# Altium schematic sheet Modulator.SchDoc: Class-D audio amplifier
size A4; Engineer: CT; SheetNumber: 1; SheetTotal: 1
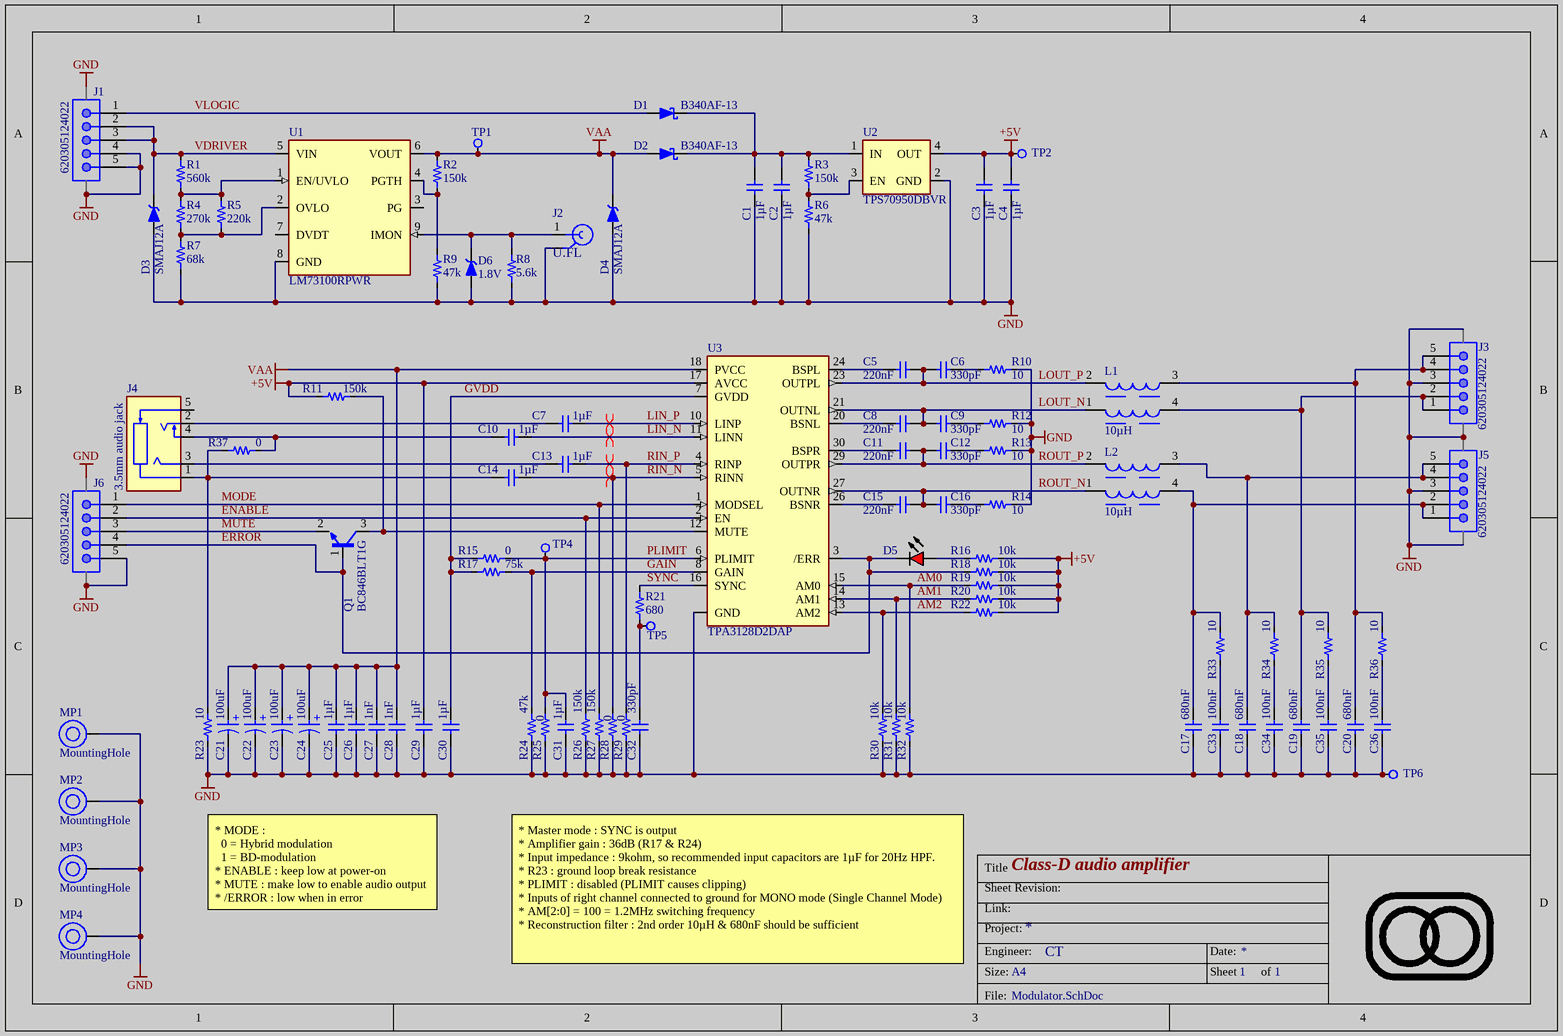
[diagram p0: Modulator.SchDoc]

## Parts
C1  value 1µF  [1206-C-N]  (hidden comment: Capacitor 1µF +/-10% 50V X7R 1206)
C2  value 1µF  [1206-C-N]  (hidden comment: Capacitor 1µF +/-10% 50V X7R 1206)
C3  value 1µF  [1206-C-N]  (hidden comment: Capacitor 1µF +/-10% 50V X7R 1206)
C4  value 1µF  [1206-C-N]  (hidden comment: Capacitor 1µF +/-10% 50V X7R 1206)
C5  value 220nF  [0805-C-N]  (hidden comment: Capacitor 220nF +/-10% 50V X7R 0805)
C6  value 330pF  [0603-C-N]  (hidden comment: Capacitor 330pF +/-5% 50V NP0 0603)
C7  value 1µF  [1206-C-N]  (hidden comment: Capacitor 1µF +/-10% 50V X7R 1206)
C8  value 220nF  [0805-C-N]  (hidden comment: Capacitor 220nF +/-10% 50V X7R 0805)
C9  value 330pF  [0603-C-N]  (hidden comment: Capacitor 330pF +/-5% 50V NP0 0603)
C10  value 1µF  [1206-C-N]  (hidden comment: Capacitor 1µF +/-10% 50V X7R 1206)
C11  value 220nF  [0805-C-N]  (hidden comment: Capacitor 220nF +/-10% 50V X7R 0805)
C12  value 330pF  [0603-C-N]  (hidden comment: Capacitor 330pF +/-5% 50V NP0 0603)
C13  value 1µF  [1206-C-N]  (hidden comment: Capacitor 1µF +/-10% 50V X7R 1206)
C14  value 1µF  [1206-C-N]  (hidden comment: Capacitor 1µF +/-10% 50V X7R 1206)
C15  value 220nF  [0805-C-N]  (hidden comment: Capacitor 220nF +/-10% 50V X7R 0805)
C16  value 330pF  [0603-C-N]  (hidden comment: Capacitor 330pF +/-5% 50V NP0 0603)
C17  value 680nF  [1206-C-N]  (hidden comment: Capacitor 680nF +/-10% 50V X7R 1206)
C18  value 680nF  [1206-C-N]  (hidden comment: Capacitor 680nF +/-10% 50V X7R 1206)
C19  value 680nF  [1206-C-N]  (hidden comment: Capacitor 680nF +/-10% 50V X7R 1206)
C20  value 680nF  [1206-C-N]  (hidden comment: Capacitor 680nF +/-10% 50V X7R 1206)
C21  Capacitance: 100uF  [WCAP-HSAH_D6.3H7.7]  (hidden comment: 875585545003)
C22  Capacitance: 100uF  [WCAP-HSAH_D6.3H7.7]  (hidden comment: 875585545003)
C23  Capacitance: 100uF  [WCAP-HSAH_D6.3H7.7]  (hidden comment: 875585545003)
C24  Capacitance: 100uF  [WCAP-HSAH_D6.3H7.7]  (hidden comment: 875585545003)
C25  value 1µF  [1206-C-N]  (hidden comment: Capacitor 1µF +/-10% 50V X7R 1206)
C26  value 1µF  [1206-C-N]  (hidden comment: Capacitor 1µF +/-10% 50V X7R 1206)
C27  value 1nF  [0603-C-N]  (hidden comment: Capacitor 1nF +/-5% 100V NP0 0603)
C28  value 1nF  [0603-C-N]  (hidden comment: Capacitor 1nF +/-5% 100V NP0 0603)
C29  value 1µF  [1206-C-N]  (hidden comment: Capacitor 1µF +/-10% 50V X7R 1206)
C30  value 1µF  [1206-C-N]  (hidden comment: Capacitor 1µF +/-10% 50V X7R 1206)
C31  value 1µF  [1206-C-N]  (hidden comment: Capacitor 1µF +/-10% 50V X7R 1206)
C32  value 330pF  [0603-C-N]  (hidden comment: Capacitor 330pF +/-5% 50V NP0 0603)
C33  value 100nF  [1206-C-N]  (hidden comment: Capacitor 100nF +/-10% 50V X7R 1206)
C34  value 100nF  [1206-C-N]  (hidden comment: Capacitor 100nF +/-10% 50V X7R 1206)
C35  value 100nF  [1206-C-N]  (hidden comment: Capacitor 100nF +/-10% 50V X7R 1206)
C36  value 100nF  [1206-C-N]  (hidden comment: Capacitor 100nF +/-10% 50V X7R 1206)
D1  B340AF-13  [DO-214AC_UNI]
D2  B340AF-13  [DO-214AC_UNI]
D3  SMAJ12A  [DO-214AC_UNI]
D4  SMAJ12A  [DO-214AC_UNI]
D5  150060RS86000  [WL-SMCW_0603_150060xx8x000]  (value not drawn)
D6  Working Voltage: 1.8V  [SOD-123-N]  (hidden comment: DDZ9678-7)
J1  620305124022  [620305124022]
J2  U.FL-R-SMT(10)  [HRS-U.FL-R-SMT_V]  (value not drawn)
J3  620305124022  [620305124022]
J4  value 3.5mm audio jack  [SJ2-35863B1-SMT-TR-Footprint-1]  (hidden comment: SJ2-35863B1-SMT-TR)
J5  620305124022  [620305124022]
J6  620305124022  [620305124022]
L1  Inductance: 10µH  [WE-LHMD_1008]  (hidden comment: 74434301008100)
L2  Inductance: 10µH  [WE-LHMD_1008]  (hidden comment: 74434301008100)
MP1  MountingHole  [PTH-M3D6.5_VIA-RING]  (no BOM)
MP2  MountingHole  [PTH-M3D6.5_VIA-RING]  (no BOM)
MP3  MountingHole  [PTH-M3D6.5_VIA-RING]  (no BOM)
MP4  MountingHole  [PTH-M3D6.5_VIA-RING]  (no BOM)
Q1  BC846BLT1G  [SOT-23-3-N]
R1  value 560k  [0603-R-N]  (hidden comment: ERJ-3EKF5603V)
R2  value 150k  [0603-R-N]  (hidden comment: Resistor 150k +/-1% 50V 0603)
R3  value 150k  [0603-R-N]  (hidden comment: Resistor 150k +/-1% 50V 0603)
R4  value 270k  [0603-R-N]  (hidden comment: RC0603FR-07270KL)
R5  value 220k  [0603-R-N]  (hidden comment: Resistor 220k 1% 0603 0.1W)
R6  value 47k  [0603-R-N]  (hidden comment: Resistor 47k +/-1% 50V 0603)
R7  value 68k  [0603-R-N]  (hidden comment: Resistor 68k +/-1% 50V 0603)
R8  value 5.6k  [0603-R-N]  (hidden comment: Resistor 5.6k +/-1% 0.1W 0603)
R9  value 47k  [0603-R-N]  (hidden comment: Resistor 47k +/-1% 50V 0603)
R10  value 10  [1206-R-N]  (hidden comment: Resistor 10E +/-1% 200V 1206)
R11  value 150k  [0603-R-N]  (hidden comment: Resistor 150k +/-1% 50V 0603)
R12  value 10  [1206-R-N]  (hidden comment: Resistor 10E +/-1% 200V 1206)
R13  value 10  [1206-R-N]  (hidden comment: Resistor 10E +/-1% 200V 1206)
R14  value 10  [1206-R-N]  (hidden comment: Resistor 10E +/-1% 200V 1206)
R15  value 0  [0603-R-N]  (hidden comment: Jumper 0R <50 mOhm 1A 0603)
R16  value 10k  [0603-R-N]  (hidden comment: Resistor 10k +/-1% 50V 0603)
R17  value 75k  [0603-R-N]  (hidden comment: Resistor 75k +/-1% 50V 0603)
R18  value 10k  [0603-R-N]  (hidden comment: Resistor 10k +/-1% 50V 0603)
R19  value 10k  [0603-R-N]  (hidden comment: Resistor 10k +/-1% 50V 0603)
R20  value 10k  [0603-R-N]  (hidden comment: Resistor 10k +/-1% 50V 0603)
R21  value 680  [0603-R-N]  (hidden comment: RMCF0603FT680R)
R22  value 10k  [0603-R-N]  (hidden comment: Resistor 10k +/-1% 50V 0603)
R23  value 10  [0603-R-N]  (hidden comment: Resistor 10R +/-1% 50V 0603)
R24  value 47k  [0603-R-N]  (hidden comment: Resistor 47k +/-1% 50V 0603)
R25  value 0  [0603-R-N]  (hidden comment: Jumper 0R <50 mOhm 1A 0603)
R26  value 150k  [0603-R-N]  (hidden comment: Resistor 150k +/-1% 50V 0603)
R27  value 150k  [0603-R-N]  (hidden comment: Resistor 150k +/-1% 50V 0603)
R28  value 0  [0603-R-N]  (hidden comment: Jumper 0R <50 mOhm 1A 0603)
R29  value 0  [0603-R-N]  (hidden comment: Jumper 0R <50 mOhm 1A 0603)
R30  value 10k  [0603-R-N]  (hidden comment: Resistor 10k +/-1% 50V 0603)
R31  value 10k  [0603-R-N]  (hidden comment: Resistor 10k +/-1% 50V 0603)
R32  value 10k  [0603-R-N]  (hidden comment: Resistor 10k +/-1% 50V 0603)
R33  value 10  [1206-R-N]  (hidden comment: Resistor 10E +/-1% 200V 1206)
R34  value 10  [1206-R-N]  (hidden comment: Resistor 10E +/-1% 200V 1206)
R35  value 10  [1206-R-N]  (hidden comment: Resistor 10E +/-1% 200V 1206)
R36  value 10  [1206-R-N]  (hidden comment: Resistor 10E +/-1% 200V 1206)
R37  value 0  [0603-R-N]  (hidden comment: Jumper 0R <50 mOhm 1A 0603)
TP1  Testpad with multiple sizes  [TP_1.5mm_0.3mmHole]  (value not drawn)  (no BOM)
TP2  Testpad with multiple sizes  [TP_1.5mm_0.3mmHole]  (value not drawn)  (no BOM)
TP4  Testpad with multiple sizes  [TP_1.5mm_0.3mmHole]  (value not drawn)  (no BOM)
TP5  Testpad with multiple sizes  [TP_1.5mm_0.3mmHole]  (value not drawn)  (no BOM)
TP6  Testpad with multiple sizes  [TP_1.5mm_0.3mmHole]  (value not drawn)  (no BOM)
U1  LM73100RPWR  [VQFN-HR]
U2  TPS70950DBVR  [SOT25-N]
U3  TPA3128D2DAP  [TSSOP28_PPad]

## Nets
+5V: C3.2 C4.2 C29.2 R11.1 R16.2 R18.1 R19.1 R20.1 R22.1 TP2.1(Pad) U2.4(OUT) U3.17(AVCC)
GND: C1.1 C2.1 C3.1 C4.1 C17.1 C18.1 C19.1 C20.1 C21.2(N) C22.2(N) C23.2(N) C24.2(N) C25.2 C26.2 C27.1 C28.1 C29.1 C30.1 C31.1 C32.2 C33.1 C34.1 C35.1 C36.1 D3.2(A) D4.2(A) D6.2(A) J1.4 J1.5 J1.MP1 J1.MP2 J2.2(GND) J3.3 J3.MP1 J3.MP2 J5.3 J5.MP1 J5.MP2 J6.5 J6.MP1 J6.MP2 MP1.1(H1) MP2.1(H1) MP3.1(H1) MP4.1(H1) R6.2 R7.1 R8.1 R9.1 R10.2 R12.2 R13.2 R14.2 R23.1 R24.1 R25.1 R26.1 R27.1 R28.1 R29.1 R30.2 R31.2 R32.2 TP6.1(Pad) U1.8(GND) U2.2(GND) U3.9(GND)
VAA: C21.1(P) C22.1(P) C23.1(P) C24.1(P) C25.1 C26.1 C27.2 C28.2 D2.2(A) D4.1(K) R2.1 TP1.1(Pad) U1.6(VOUT) U3.18(PVCC)
AM0: R19.2 R32.1 U3.15(AM0)
AM1: R20.2 R31.1 U3.14(AM1)
AM2: R22.2 R30.1 U3.13(AM2)
ENABLE: J6.2 R26.2 U3.2(EN)
ERROR: D5.1(K) J6.4 Q1.1(B) R18.2 U3.3(/ERR)
GAIN: R17.1 R24.2 U3.8(GAIN)
GVDD: C30.2 R15.1 R17.2 U3.7(GVDD)
LIN_N: C10.1 U3.11(LINN)
LIN_P: C7.1 U3.10(LINP)
LOUT_N: C8.2 C9.2 L1.1 U3.21(OUTNL)
LOUT_P: C5.2 C6.2 L1.2 U3.23(OUTPL)
MODE: J6.1 R27.2 U3.1(MODSEL)
MUTE: J6.3 Q1.2(E)
PLIMIT: C31.2 R15.2 R25.2 TP4.1(Pad) U3.6(PLIMIT)
RIN_N: C14.1 R28.2 U3.5(RINN)
RIN_P: C13.1 R29.2 U3.4(RINP)
ROUT_N: C15.2 C16.2 L2.1 U3.27(OUTNR)
ROUT_P: C11.2 C12.2 L2.2 U3.29(OUTPR)
SYNC: R21.2 U3.16(SYNC)
VDRIVER: D3.1(K) J1.2 J1.3 R1.2 U1.5(VIN)
VLOGIC: D1.2(A) J1.1
NetC1_2: C1.2 C2.2 D1.1(K) D2.1(K) R3.1 U2.1(IN)
NetC5_1: C5.1 U3.24(BSPL)
NetC6_1: C6.1 R10.1
NetC7_2: C7.2 J4.2
NetC8_1: C8.1 U3.20(BSNL)
NetC9_1: C9.1 R12.1
NetC10_2: C10.2 J4.4 R37.2
NetC11_1: C11.1 U3.30(BSPR)
NetC12_1: C12.1 R13.1
NetC13_2: C13.2 J4.3
NetC14_2: C14.2 J4.1 R23.2 R37.1
NetC15_1: C15.1 U3.26(BSNR)
NetC16_1: C16.1 R14.1
NetC17_2: C17.2 J5.1 J5.2 L2.4 R33.2
NetC18_2: C18.2 J5.4 J5.5 L2.3 R34.2
NetC19_2: C19.2 J3.1 J3.2 L1.4 R35.2
NetC20_2: C20.2 J3.4 J3.5 L1.3 R36.2
NetC32_1: C32.1 R21.1 TP5.1(Pad)
NetC33_2: C33.2 R33.1
NetC34_2: C34.2 R34.1
NetC35_2: C35.2 R35.1
NetC36_2: C36.2 R36.1
NetD5_2: D5.2(A) R16.1
NetD6_1: D6.1(K) J2.1(SIG) R8.2 U1.9(IMON)
NetQ1_3: Q1.3(C) R11.2 U3.12(MUTE)
NetR1_1: R1.1 R4.2 R5.2 U1.1(EN/UVLO)
NetR2_2: R2.2 R9.2 U1.4(PGTH)
NetR3_2: R3.2 R6.1 U2.3(EN)
NetR4_1: R4.1 R5.1 R7.2 U1.2(OVLO)

Not connected (* = marked no-connect by the designer): J4 5; U1 3(PG) 7(DVDT)

## Layout directives
differential pair: LIN_N, LIN_P, RIN_N, RIN_P

## Notes on the sheet
- * MODE :
  0 = Hybrid modulation
  1 = BD-modulation
  * ENABLE : keep low at power-on
  * MUTE : make low to enable audio output
  * /ERROR : low when in error
- * Master mode : SYNC is output
  * Amplifier gain : 36dB (R17 & R24)
  * Input impedance : 9kohm, so recommended input capacitors are 1µF for 20Hz HPF.
  * R23 : ground loop break resistance
  * PLIMIT : disabled (PLIMIT causes clipping)
  * Inputs of right channel connected to ground for MONO mode (Single Channel Mode)
  * AM[2:0] = 100 = 1.2MHz switching frequency
  * Reconstruction filter : 2nd order 10µH & 680nF should be sufficient
- Title
- Sheet Revision:
- Link:
- Size:
- Project:
- Engineer:
- A4
- Date:
- Sheet
- of
- File:
- (in symbol CMP-171-000008-3) +

## Library data of the parts
C1-C4 = CMP-072-000852-15: WCAP-CSGP Multilayer Ceramic Chip Capacitor, General Purpose, size 1206, X7R, 1µF, 50VDC; Page Part #: CCOK105; Technical Reference: X7R1206105K050DFCT10000; Capacitor Type: MLCC; Tolerance: 10%; Insulation Resistance: 0.5GO; Dissipation Factor: 3%; Source: WCAP-CSGP.SchLib; Width: 1.6mm; Voltage Rating: 50V; Case/Package: 1206; Min Operating Temperature: -55°C; Design Item ID: 885012208093; JLCPCB Part #: C1848; Height: 1.6mm; Match Code: WCAP-CSGP; Mounting Technology: SMT; ComponentLink2Description: Datasheet Link; Packaging: Tape and Reel; Usage: General Purpose; Max Operating Temperature: 125°C; ComponentLink1Description: Website Link; Length: 3.2mm; Dielectric: X7R; ComponentLink2URL: https://www.we-online.com/redexpert/spec/885012208093?ad; Pins: 2; ComponentLink1URL: https://www.we-online.com/redexpert/article/885012208093?ad
C5 C8 C11 C15 = CMP-072-000738-14: WCAP-CSGP Multilayer Ceramic Chip Capacitor, General Purpose, size 0805, X7R, 220nF, 50VDC; Capacitor Type: MLCC; Technical Reference: X7R0805224K050DFCT10000; Insulation Resistance: 2.3GO; Dissipation Factor: 3%; Tolerance: 10%; Width: 1.25mm; Dielectric: X7R; Case/Package: 0805; ComponentLink2Description: Datasheet Link; Usage: General Purpose; Pins: 2; JLCPCB Part #: C5378; Design Item ID: 885012207100; ComponentLink2URL: https://www.we-online.com/redexpert/spec/885012207100?ad; Max Operating Temperature: 125°C; Length: 2mm; Source: WCAP-CSGP.SchLib; Packaging: Tape and Reel; ComponentLink1URL: https://www.we-online.com/redexpert/article/885012207100?ad; Match Code: WCAP-CSGP; Voltage Rating: 50V; ComponentLink1Description: Website Link; Mounting Technology: SMT; Height: 1.25mm; Min Operating Temperature: -55°C
C6 C9 C12 C16 C32 = CMP-072-000131-14: WCAP-CSGP Multilayer Ceramic Chip Capacitor, General Purpose, size 0603, NP0, 330pF, 50VDC; Tolerance: 5%; Q Factor: 1000; Technical Reference: NP00603331J050DFCT10000; Insulation Resistance: 10GO; Capacitor Type: MLCC; Match Code: WCAP-CSGP; Max Operating Temperature: 125°C; ComponentLink1Description: Website Link; Length: 1.6mm; ComponentLink2URL: https://www.we-online.com/redexpert/spec/885012006060?ad; Min Operating Temperature: -55°C; Voltage Rating: 50V; Mounting Technology: SMT; ComponentLink1URL: https://www.we-online.com/redexpert/article/885012006060?ad; Design Item ID: 885012006060; Source: WCAP-CSGP.SchLib; JLCPCB Part #: C62784; Pins: 2; Height: 0.8mm; ComponentLink2Description: Datasheet Link; Dielectric: NP0; Packaging: Tape and Reel; Width: 0.8mm; Usage: General Purpose; Case/Package: 0603
C7 C10 C13 C14 C25 C26 C29-C31 = CMP-072-000852-15: WCAP-CSGP Multilayer Ceramic Chip Capacitor, General Purpose, size 1206, X7R, 1µF, 50VDC; Page Part #: CCOK105; Dissipation Factor: 3%; Tolerance: 10%; Technical Reference: X7R1206105K050DFCT10000; Insulation Resistance: 0.5GO; Capacitor Type: MLCC; Mounting Technology: SMT; ComponentLink2Description: Datasheet Link; Width: 1.6mm; Length: 3.2mm; Match Code: WCAP-CSGP; Voltage Rating: 50V; Packaging: Tape and Reel; ComponentLink1Description: Website Link; ComponentLink2URL: https://www.we-online.com/redexpert/spec/885012208093?ad; Pins: 2; Height: 1.6mm; Max Operating Temperature: 125°C; Min Operating Temperature: -55°C; Dielectric: X7R; Design Item ID: 885012208093; Source: WCAP-CSGP.SchLib; Usage: General Purpose; JLCPCB Part #: C1848; Case/Package: 1206; ComponentLink1URL: https://www.we-online.com/redexpert/article/885012208093?ad
C17-C20 = CMP-072-000851-13: WCAP-CSGP Multilayer Ceramic Chip Capacitor, General Purpose, size 1206, X7R, 680nF, 50VDC; Capacitor Type: MLCC; Insulation Resistance: 0.7GO; Technical Reference: X7R1206684K050DFCT10000; Tolerance: 10%; Dissipation Factor: 3%; Voltage Rating: 50V; Pins: 2; Source: WCAP-CSGP.SchLib; Mounting Technology: SMT; Case/Package: 1206; Match Code: WCAP-CSGP; Design Item ID: 885012208092; Usage: General Purpose; Height: 1.6mm; Packaging: Tape and Reel; Max Operating Temperature: 125°C; Min Operating Temperature: -55°C; ComponentLink1URL: https://www.we-online.com/redexpert/article/885012208092?ad; Length: 3.2mm; Dielectric: X7R; JLCPCB Part #: C282780; ComponentLink2Description: Datasheet Link; Width: 1.6mm; ComponentLink2URL: https://www.we-online.com/redexpert/spec/885012208092?ad; ComponentLink1Description: Website Link
C21-C24 = CMP-171-000008-3: WCAP-HSAH Aluminum Hybrid Polymer Capacitor, SMT, D6.3 x H7.7mm, 100uF, 25V; Manufacturer: Wurth Elektronik; Leakage Current: 25uA; Dissipation Factor: 14%; Ripple Current: 1400mA; ESR: 30mOhm; Endurance: 4000h; Packaging: Tape and Reel; ComponentLink2Description: Datasheet Link; Design Item ID: 875585545003; ComponentLink1Description: Website Link; Diameter: 6.3mm; JLCPCB Part #: C22395169; Category: Aluminum Hybrid Polymer Capacitors; Manufacturer Part Number: 875585545003; Operating Temperature Min: -55°C; Mount: Surface Mount; Component Type: Standard; Rated Voltage (DC): 25V; Source: WCAP-HSAH.SchLib; Height: 7.7mm; Pin Count: 2; Operating Temperature Max: 125°C; ComponentLink2URL: https://www.we-online.com/redexpert/spec/875585545003?ad; Match Code: WCAP-HSAH; ComponentLink1URL: https://www.we-online.com/redexpert/article/875585545003?ad
C27 C28 = CMP-072-000145-17: WCAP-CSGP Multilayer Ceramic Chip Capacitor, General Purpose, size 0603, NP0, 1nF, 100VDC; FLIR Part #: YCAM1N-1; Capacitor Type: MLCC; Insulation Resistance: 10GO; Technical Reference: NP00603102J100DFCT10000; Tolerance: 5%; Q Factor: 1000; Voltage Rating: 100V; ComponentLink2Description: Datasheet Link; ComponentLink2URL: https://www.we-online.com/redexpert/spec/885012006085?ad; JLCPCB Part #: C153291; ComponentLink1Description: Website Link; Usage: General Purpose; Height: 0.8mm; Width: 0.8mm; Source: WCAP-CSGP.SchLib; Match Code: WCAP-CSGP; Pins: 2; Length: 1.6mm; ComponentLink1URL: https://www.we-online.com/redexpert/article/885012006085?ad; Dielectric: NP0; Packaging: Tape and Reel; Design Item ID: 885012006085; Case/Package: 0603; Min Operating Temperature: -55°C; Max Operating Temperature: 125°C; Mounting Technology: SMT; Page Part #: ?
C33-C36 = CMP-072-000846-14: WCAP-CSGP Multilayer Ceramic Chip Capacitor, General Purpose, size 1206, X7R, 100nF, 50VDC; Dissipation Factor: 2.5%; Capacitor Type: MLCC; Tolerance: 10%; Technical Reference: X7R1206104K050DFCT10000; Insulation Resistance: 5GO; Case/Package: 1206; Source: WCAP-CSGP.SchLib; Match Code: WCAP-CSGP; Mounting Technology: SMT; ComponentLink1URL: https://www.we-online.com/redexpert/article/885012208087?ad; Min Operating Temperature: -55°C; ComponentLink2URL: https://www.we-online.com/redexpert/spec/885012208087?ad; Pins: 2; JLCPCB Part #: C82601; Usage: General Purpose; Max Operating Temperature: 125°C; Packaging: Tape and Reel; Voltage Rating: 50V; Width: 1.6mm; Dielectric: X7R; Length: 3.2mm; ComponentLink2Description: Datasheet Link; Height: 0.8mm; ComponentLink1Description: Website Link; Design Item ID: 885012208087
D1 D2 = CMP-004-00050-6: Diode 40 V 3A Surface Mount SMAF; Forward Voltage: 500 mV @ 3 A; Max Reverse Voltage (DC): 40V; JLCPCB Part #: C172880; Forward Current: 3A; Mounting Technology: Surface Mount; Case/Package: SMA; RoHS Compliant: Yes; Series: -; Packaging: Cut Tape
D3 D4 = CMP-104-000003-5: SMAJ Series 19.9 V 0.4 kW Surface Mount Uni-Directional TVS Diode - DO-214AC; Manufacturer Part Number: 824500121; Manufacturer: Wurth Elektronik; Polarity: Unidirectional; Power Dissipation: 400W; Operating Voltage (DC): 12V; (Reverse) Breakdown Voltage: 14V; Match Code: WE-TVSP; Clamping Voltage: 19.9V; Value: 12V; (Reverse) Peak Pulse Current: 20.1A; Length: 4.5mm; Packaging: Tape and Reel; Case/Size Code: DO-214AC; Operating Temperature Min: -65°C; Height: 2.087mm; Source: WE-TVSP.SchLib; Component Type: Standard; Category: Surge Protection; Mount: Surface Mount; Pin Count: 2; ComponentLink2URL: https://www.we-online.com/redexpert/spec/824500121?ad; Design Item ID: 824500121; JLCPCB Part #: C89613; ComponentLink2Description: Datasheet Link; ComponentLink1URL: https://www.we-online.com/redexpert/article/824500121?ad; Width: 2.79mm; Operating Temperature Max: 150°C; ComponentLink1Description: Website Link
D5 = CMP-002-001080-9: WL-SMCW Mono-color Chip LED Waterclear, size 0603, Red, 2V, 60°; Manufacturer: Wurth Elektronik; Case/Size Code: 0603; Dominant Wavelength: 624nm; Peak Wavelength: 632nm; Luminous Intensity: 800mcd; Chip Technology: AlInGaP; Match Code: WL-SMCW; Source: WL-SMCW.SchLib; Length: 1.6mm; Height: 0.95mm; Emitting Color: Red; Forward Voltage: 2V; ComponentLink1URL: https://www.we-online.com/redexpert/article/150060RS86000?ad; Operating Temperature Min: -40°C; Mount: Surface Mount; Pin Count: 2; Design Item ID: 150060RS86000; ComponentLink1Description: Website Link; Packaging: Tape and Reel; ComponentLink2URL: https://www.we-online.com/redexpert/spec/150060RS86000?ad; JLCPCB Part #: C5875741; Operating Temperature Max: 85°C; Manufacturer Part Number: 150060RS86000; ComponentLink2Description: Datasheet Link; Viewing Angle: 60°; Category: Signal LEDs; Component Type: Standard; Width: 0.8mm
D6 = CMP-004-00056-2: Vz=1.8V 1.71V~1.89V Izt=50uA P=500mW; Forward Voltage: 900mV; Max Reverse Current: 7.5uA; Test Current: 50uA; Power Dissipation: 500mW; Tolerance: 5%; Series: -; Package Quantity: 3000; Zener Current: 7.5uA; Min Operating Temperature: -65°C; Reach SVHC Compliant: No; Width: 1.7mm; Max Operating Temperature: 150°C; Max Power Dissipation: 500mW; Case/Package: SOD-123-2; Zener Voltage: 1.8V; Weight: 0.000353oz; Height: 1.35mm; Lead Free: Lead Free; Radiation Hardening: No; Length: 3.85mm; JLCPCB Part #: C150464; Max Reverse Leakage Current: 7.5uA; Power Rating: 500mW; Packaging: Tape and Reel; Pins: 2; Mounting Technology: Surface Mount; Voltage Tolerance: 5%; RoHS Compliant: Yes
J1 J3 J5 J6 = CMP-047-000052-7: WR-WTB SMT Male Vertical Shrouded Header, pitch 2mm, 5p; Withstanding Voltage: 800VAC; Pin Number: 5; Working Voltage: 100VAC; Contact Resistance: 20mOhm; Rated Current: 2A; Type: Vertical; JLCPCB Part #: C265085; ComponentLink2Description: Datasheet; Part Number: 620305124022; Pin Count: 5; Publisher: Wurth Elektronik; Component Type: Standard; ComponentLink1Description: Manufacturer; Source: WR-WTB_2.00mm.SchLib; Mounting Technology: SMT; Pitch: 2mm; Operating Temperature: -25 to +85degC; Published Date: January 2020; ComponentLink1URL: http://www.we-online.de; Design Item ID: 620305124022; Gender: Male; Packaging: Tape and Reel; ComponentLink2URL: https://www.we-online.com/catalog/datasheet/620305124022.pdf
J2 = CMP-002-00035-12: Ultra Small Surface Mount Coaxial Connector, 50 Ohm, -40 to 90 degC, 3-Pin SMD, RoHS, Tape and Reel; pin to pad: 1>3 2>1+2; Manufacturer: Hirose Electric; Resistance: 50Ohm; Connector Type: RF&Coax; Value: U.FL; Package Reference: U.FL-R-SMT; Datasheet Version: Aug-16; Package Description: 3-Pin Surface Mount Device, Body 2.6 x 2.6 mm; Fastening Type: Snap; Datasheet URL: https://www.hirose.com/product/en/download_file/key_name/U.FL/category/Catalog/doc_file_id/31697/?file_category_id=4&item_id=15&is_series=1; Manufacturer URL: https://www.hirose.com; Contact Plating: Gold; Max Operating Temperature: 90°C; Package Quantity: 2500; Impedance: 50Ohm; JLCPCB Part #: C88373; Packaging: TapeandReel; Min Operating Temperature: -40°C; Mounting Technology: SM; RoHS Compliant: True; Contact Material: Brass; Case/Package: U.FL-R-SMT
J4 = CMP-002-00128-5: 3.5 mm, Stereo, Right Angle, Surface Mount (SMT), Audio Jack Connector; Number of Ports: 1; Number of Conductors: 3; Shielding: Unshielded; JLCPCB Part #: C381135; Color: Black; Orientation: Horizontal; Connector Type: Jack
L1 L2 = CMP-175-000001-2: WE-LHMD SMT High Current Inductor, size 1008, 10µH, 3.2A; Manufacturer: Wurth Elektronik; Saturation Current: 18A; Inductance Tolerance: +/-15%; DC Resistance: 45mO; Case/Size Code: 1008; ComponentLink1URL: https://www.we-online.com/redexpert/article/74434301008100?ad; Operating Temperature Min: -40°C; Pin Count: 4; Component Type: Standard; Width: 10mm; Rated Current: 3.2A; ComponentLink2Description: Datasheet Link; ComponentLink2URL: https://www.we-online.com/redexpert/spec/74434301008100?ad; Category: Inductors for Digital Audio; Length: 10mm; Design Item ID: 74434301008100; Match Code: WE-LHMD; Operating Temperature Max: 125°C; Source: WE-LHMD.SchLib; Height: 8mm; Mount: Surface Mount; Manufacturer Part Number: 74434301008100; Packaging: Tape and Reel; ComponentLink1Description: Website Link
MP1-MP4 = CMP-00028-00004-15: Mounting hole.  Add this so that mounting holes placed in your design don't automagically disappear when you import changes from the schematic.; Pins: 1
Q1 = CMP-013-00048-14: NPN Ic=100mA Vceo=65V hfe=200~450 P=225mW SOT-23; Ic Max: 100mA; Vce Max: 65V; Case/Package: SOT-23-3; Transistor Type: NPN; JLCPCB Part #: C82477
R1 = CMP-009-00383-2: Res Thick Film 0603 560K Ohm 1% 0.1W ±100ppm/°C Molded SMD Punched Carrier T/R; Max Power Dissipation: 100mW; Voltage Rating: 75V; Resistance Tolerance: 1%; Radiation Hardening: No; Package Quantity: 1; Width: 0.8mm; Temperature Coefficient: 100ppm/°C; Military Standard: Not; Pins: 2; Max Operating Temperature: 155°C; Termination: SMD/SMT; Mounting Technology: Surface Mount; Series: ERJ; Packaging: Tape and Reel; JLCPCB Part #: C25822; Number of Terminations: 2; Power Rating: 100mW; Construction: Rectangular; Features: Automotive AEC-Q200; Case/Package: 0603; Resistor Type: Thick Film; RoHS Compliant: Yes; Contact Plating: Tin; Depth: 0.8mm; Case Code (Imperial): 0603; Length: 1.6mm; Case Code (Metric): 1608; Tolerance: 1%; Min Operating Temperature: -55°C; Reach SVHC Compliant: No; Height: 0.022inch; Voltage Rating (DC): 75V
R2 R3 R11 R26 R27 = CMP-009-00237-19: Chip Resistor, Thick Film, General Purpose, 0603, 100mW, 50V, 150 kOhm, +/-1%; FLIR Part #: YRES150K-1; Tolerance: 1%; Elements: 1; Min Operating Temperature: -55°C; Voltage Rating: 50V; Max Operating Temperature: 155°C; Resistor Type: Thick Film; JLCPCB Part #: C22807; Pins: 2; RoHS Compliant: Yes; Usage: General Purpose; Mounting Technology: SMT; Power Rating: 100mW; Case/Package: 0603
R4 = CMP-009-00384-1: SMD Chip Resistor, 270 kOhm, ï¿½ 1%, 100 mW, 0603 [1608 Metric], Thick Film, General Purpose; Max Power Dissipation: 100mW; Voltage Rating (DC): 50V; Temperature Coefficient: 100ppm/°C; Max Operating Temperature: 155°C; Pins: 2; Series: RC; Length: 1.6mm; Reach SVHC Compliant: Unknown; Military Standard: Not; JLCPCB Part #: C22965; Resistance Tolerance: 1%; Features: Moisture Resistant; Case/Package: 0603; Power Rating: 100mW; Case Code (Imperial): 0603; Case Code (Metric): 1608; RoHS Compliant: Yes; Construction: Rectangular; Packaging: Tape and Reel; Resistor Type: Thick Film; Height: 0.45mm; Termination: SMD/SMT; Lead Free: Lead Free; Min Operating Temperature: -55°C; Width: 0.8mm; Depth: 0.8mm; Voltage Rating: 50V; Voltage Rating (AC): 50V; Number of Terminations: 2; Tolerance: 1%
R5 = CMP-009-00344-7: Res Thick Film 0603 220K Ohm 1% 0.1W(1/10W) ±100ppm/C Pad SMD T/R; FLIR Part #: YRES220K-1; Elements: 1; Voltage Rating: 75V; Temperature Coefficient: 100ppm/°C; Power Rating: 100mW; Usage: General Purpose; Pins: 2; Resistor Type: Thick Film; Mounting Technology: SMT; Lead Free: Lead Free; Case/Package: 0603; Tolerance: 1%; RoHS Compliant: Yes; Max Operating Temperature: 155°C; Min Operating Temperature: -55°C; JLCPCB Part #: C22961
R6 R9 R24 = CMP-009-00195-22: Chip Resistor, Thick Film, General Purpose, 0603, 100mW, 50V, 47 kOhm, +/-1%; FLIR Part #: YRES47K-1; Page Part #: ROQF4702; Tolerance: 1%; Elements: 1; Temperature Coefficient: 100ppm/°C; Voltage Rating: 50V; Case/Package: 0603; Usage: General Purpose; Min Operating Temperature: -55°C; JLCPCB Part #: C25819; REACH SVHC: No SVHC; Pins: 2; Mounting Technology: SMT; Max Operating Temperature: 155°C; Power Rating: 100mW; Resistor Type: Thick Film
R7 = CMP-009-00207-23: Chip Resistor, Thick Film, General Purpose, 0603, 100mW, 50V, 68 kOhm, +/-1%; Page Part #: ROQF6802; Tolerance: 1%; Elements: 1; Usage: General Purpose; Pins: 2; RoHS Compliant: Yes; Power Rating: 100mW; Max Operating Temperature: 155°C; Mounting Technology: SMT; Voltage Rating: 50V; Case/Package: 0603; JLCPCB Part #: C114633; Min Operating Temperature: -55°C; Resistor Type: Thick Film
R8 = CMP-009-00287-10: Res Thick Film 0603 5.6K Ohm 1% 0.1W(1/10W) ±100ppm/C Pad SMD T/R; Usage: General Purpose; Elements: 1; Temperature Coefficient: 100ppm/°C; Power Rating: 100mW; Voltage Rating: 75V; Case/Package: 0603; JLCPCB Part #: C23189; Mounting Technology: SMT; Min Operating Temperature: -55°C; Max Operating Temperature: 155°C; Pins: 2; Resistor Type: Thick Film; RoHS Compliant: Yes; Lead Free: Lead Free; Features: Moisture Resistant; Tolerance: 1%
R10 R12-R14 R33-R36 = CMP-009-00238-9: Chip Resistor, Thick Film, General Purpose, 1206, 250mW, 200V, 10 Ohm, +/-1%; Tolerance: 1%; Elements: 1; JLCPCB Part #: C17903; Case/Package: 1206; Power Rating: 250mW; Usage: General Purpose; Resistor Type: Thick Film; Min Operating Temperature: -55°C; Pins: 2; Voltage Rating: 200V; Mounting Technology: SMT; Max Operating Temperature: 155°C
R15 R25 R28 R29 R37 = CMP-009-00006-26: Chip Jumper, Thick Film, Jumper, 0603, 100mW, 1A, 0 Ohm, <50 mOhm; FLIR Part #: YRES0E-1; Page Part #: ROQJ0000; Tolerance: 50 mOhm; Voltage Rating: 75V; Elements: 1; Usage: Jumper; Case/Package: 0603; Power Rating: 100mW; Current Rating: 1A; Min Operating Temperature: -55°C; RoHS Compliant: True; Resistor Type: Thick Film; Max Operating Temperature: 155°C; JLCPCB Part #: C21189; Pins: 2; Mounting Technology: SMT
R16 R18-R20 R22 R30-R32 = CMP-009-00017-28: Chip Resistor, Thick Film, General Purpose, 0603, 100mW, 50V, 10 kOhm, +/-1%; FLIR Part #: YRES10K-1; Page Part #: ROQF1002; Elements: 1; Tolerance: 1%; Usage: General Purpose; Voltage Rating: 50V; RoHS Compliant: Yes; JLCPCB Part #: C25804; Power Rating: 100mW; Pins: 2; Min Operating Temperature: -55°C; Resistor Type: Thick Film; Case/Package: 0603; Max Operating Temperature: 155°C; Mounting Technology: SMT
R17 = CMP-009-00319-10: Chip Resistor, Thick Film, General Purpose, 0603, 100mW, 50V, 75 kOhm, +/-1%; Tolerance: 1%; Elements: 1; Pins: 2; Resistor Type: Thick Film; Case/Package: 0603; JLCPCB Part #: C23242; Max Operating Temperature: 155°C; Mounting Technology: SMT; RoHS Compliant: Yes; Voltage Rating: 50V; Usage: General Purpose; Power Rating: 100mW; Min Operating Temperature: -55°C
R21 = CMP-009-00386-1: Res Thick Film 0603 680 Ohm 1% 1/10W ±100ppm/°C Molded SMD SMD Paper T/R; Voltage Rating: 75V; Max Power Dissipation: 100mW; JLCPCB Part #: C23228; Length: 0.061inch; Number of Terminations: 2; Temperature Coefficient: 100ppm/°C; Packaging: Tape and Reel; RoHS Compliant: Yes; Features: Automotive AEC-Q200; Series: RMCF; Case/Package: 0603; Height: 0.022inch; Package Quantity: 5000; Case Code (Imperial): 0603; Contact Plating: Tin,Matte; Tolerance: 1%; Min Operating Temperature: -55°C; Mounting Technology: Surface Mount; Radiation Hardening: No; Case Code (Metric): 1608; Max Operating Temperature: 155°C; Width: 0.031inch; Lead Free: Lead Free
R23 = CMP-009-00230-18: Chip Resistor, Thick Film, General Purpose, 0603, 100mW, 50V, 10 Ohm, +/-1%; Tolerance: 1%; Elements: 1; Temperature Coefficient: 200ppm/°C; Pins: 2; Max Operating Temperature: 155°C; Mounting Technology: SMT; RoHS Compliant: Yes; JLCPCB Part #: C22859; Voltage Rating: 50V; Case/Package: 0603; Resistor Type: Thick Film; Min Operating Temperature: -55°C; Power Rating: 100mW; Usage: General Purpose
TP1 TP2 TP4-TP6 = CMP-027-000000-17: Testpad land; Component Type: Standard; Design Item ID: Testpad; Pin Count: 1
U1 = CMP-019-00108-1: 2.7V~23V 5.5A VQFN-10-HR(2x2) Power Distribution Switches ROHS; JLCPCB Part #: C3210761; RoHS Compliant: Yes
U2 = CMP-019-00109-1: Linear Voltage Regulator IC Positive Fixed 1 Output 5V 150mA SOT-23-5; pin to pad: 4>5; Number of Outputs: 1; Dropout Voltage: 690mV; Max Supply Voltage: 30V; Min Input Voltage: 2.7V; Min Current Limit: 200mA; Power Supply Rejection Ratio (PSRR): 80dB; Accuracy: 2%; Output Voltage: 5V; Package Quantity: 1; Pins: 5; Min Operating Temperature: -40°C; Series: -; Case/Package: SOT-23-5; Output Type: Fixed; Number of Regulators: 1; Lead Free: Lead Free; Output Current: 150mA; Max Output current: 150mA; Nominal Output Voltage: 5V; Reach SVHC Compliant: No; Radiation Hardening: No; RoHS Compliant: Yes; Polarity: Positive; JLCPCB Part #: C96028; Mounting Technology: Surface Mount; Max Operating Temperature: 125°C; Packaging: Tape and Reel
U3 = CMP-014-00029-7: Audio Amp Speaker 1-CH Mono/2-CH Stereo 60W Class-D 32-Pin HTSSOP EP Tube; pin to pad: 9>9+22+25+28+33 18>18+19+31+32; Max Output Power: 30W; Max Operating Temperature: 85°C; JLCPCB Part #: C473362; Series: -; Packaging: Rail/Tube; RoHS Compliant: Yes; Case/Package: HTSSOP; Min Operating Temperature: -40°C; Mounting Technology: Surface Mount